# EAGLE design Prop_Fan (EAGLE 6.6.0)
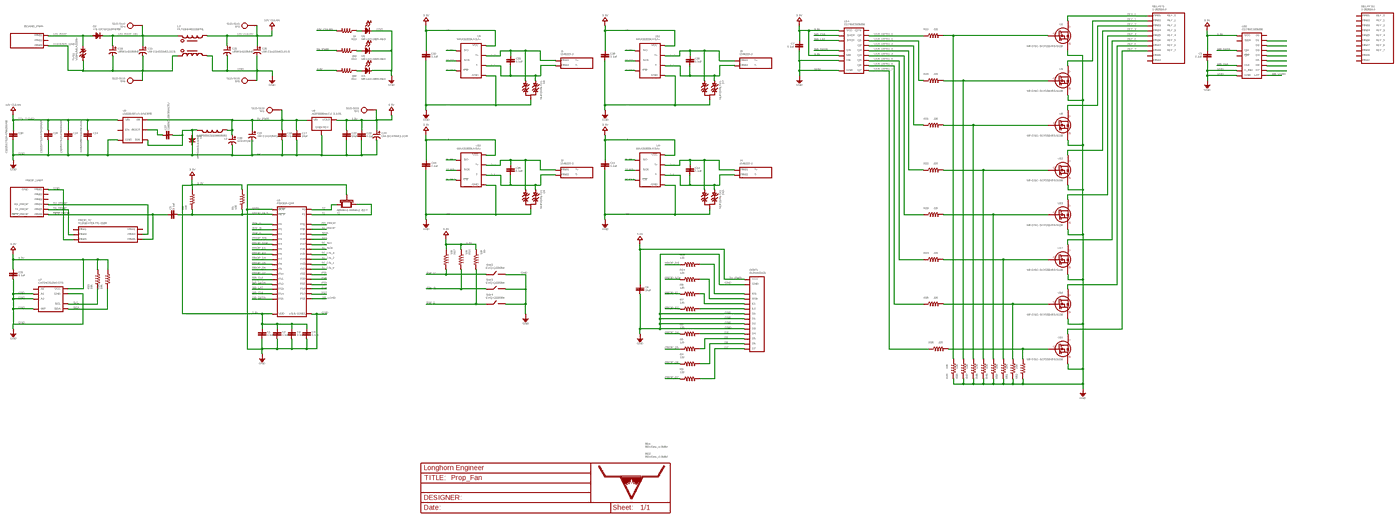
[diagram p0: schematic, sheet 1, overview]
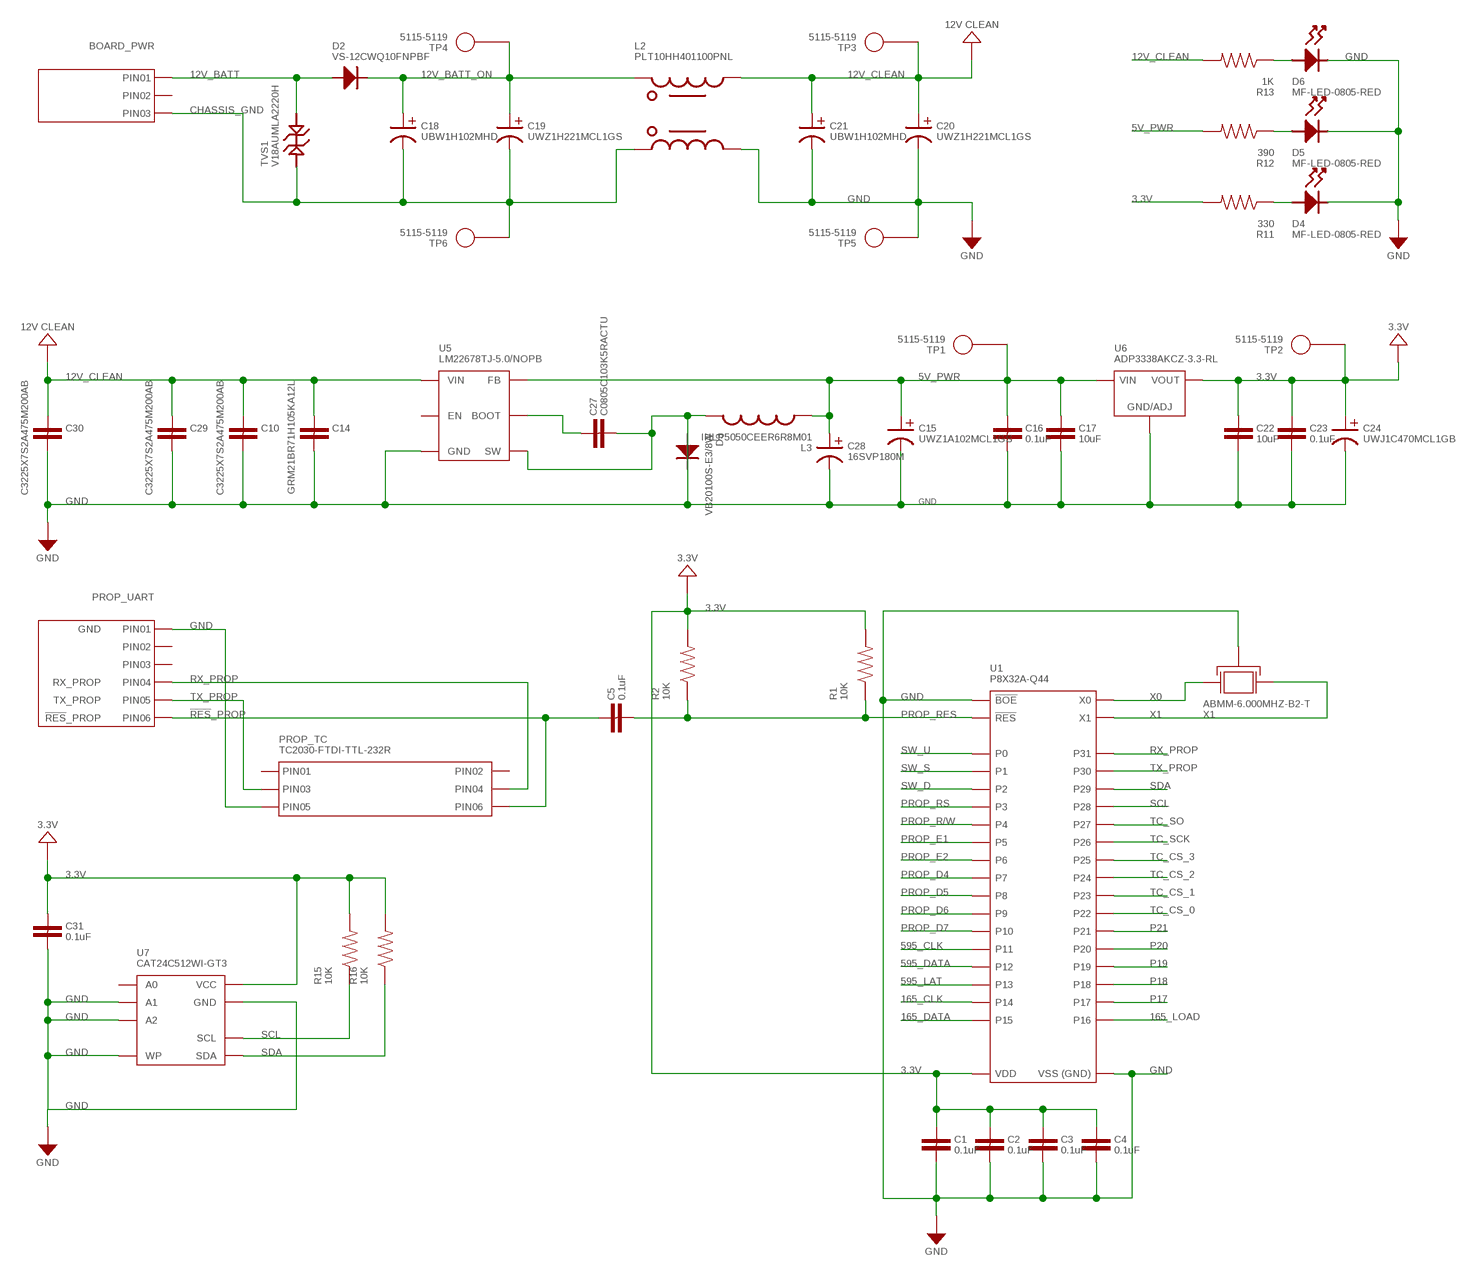
[diagram p1: schematic, sheet 1, part 1 of 4]
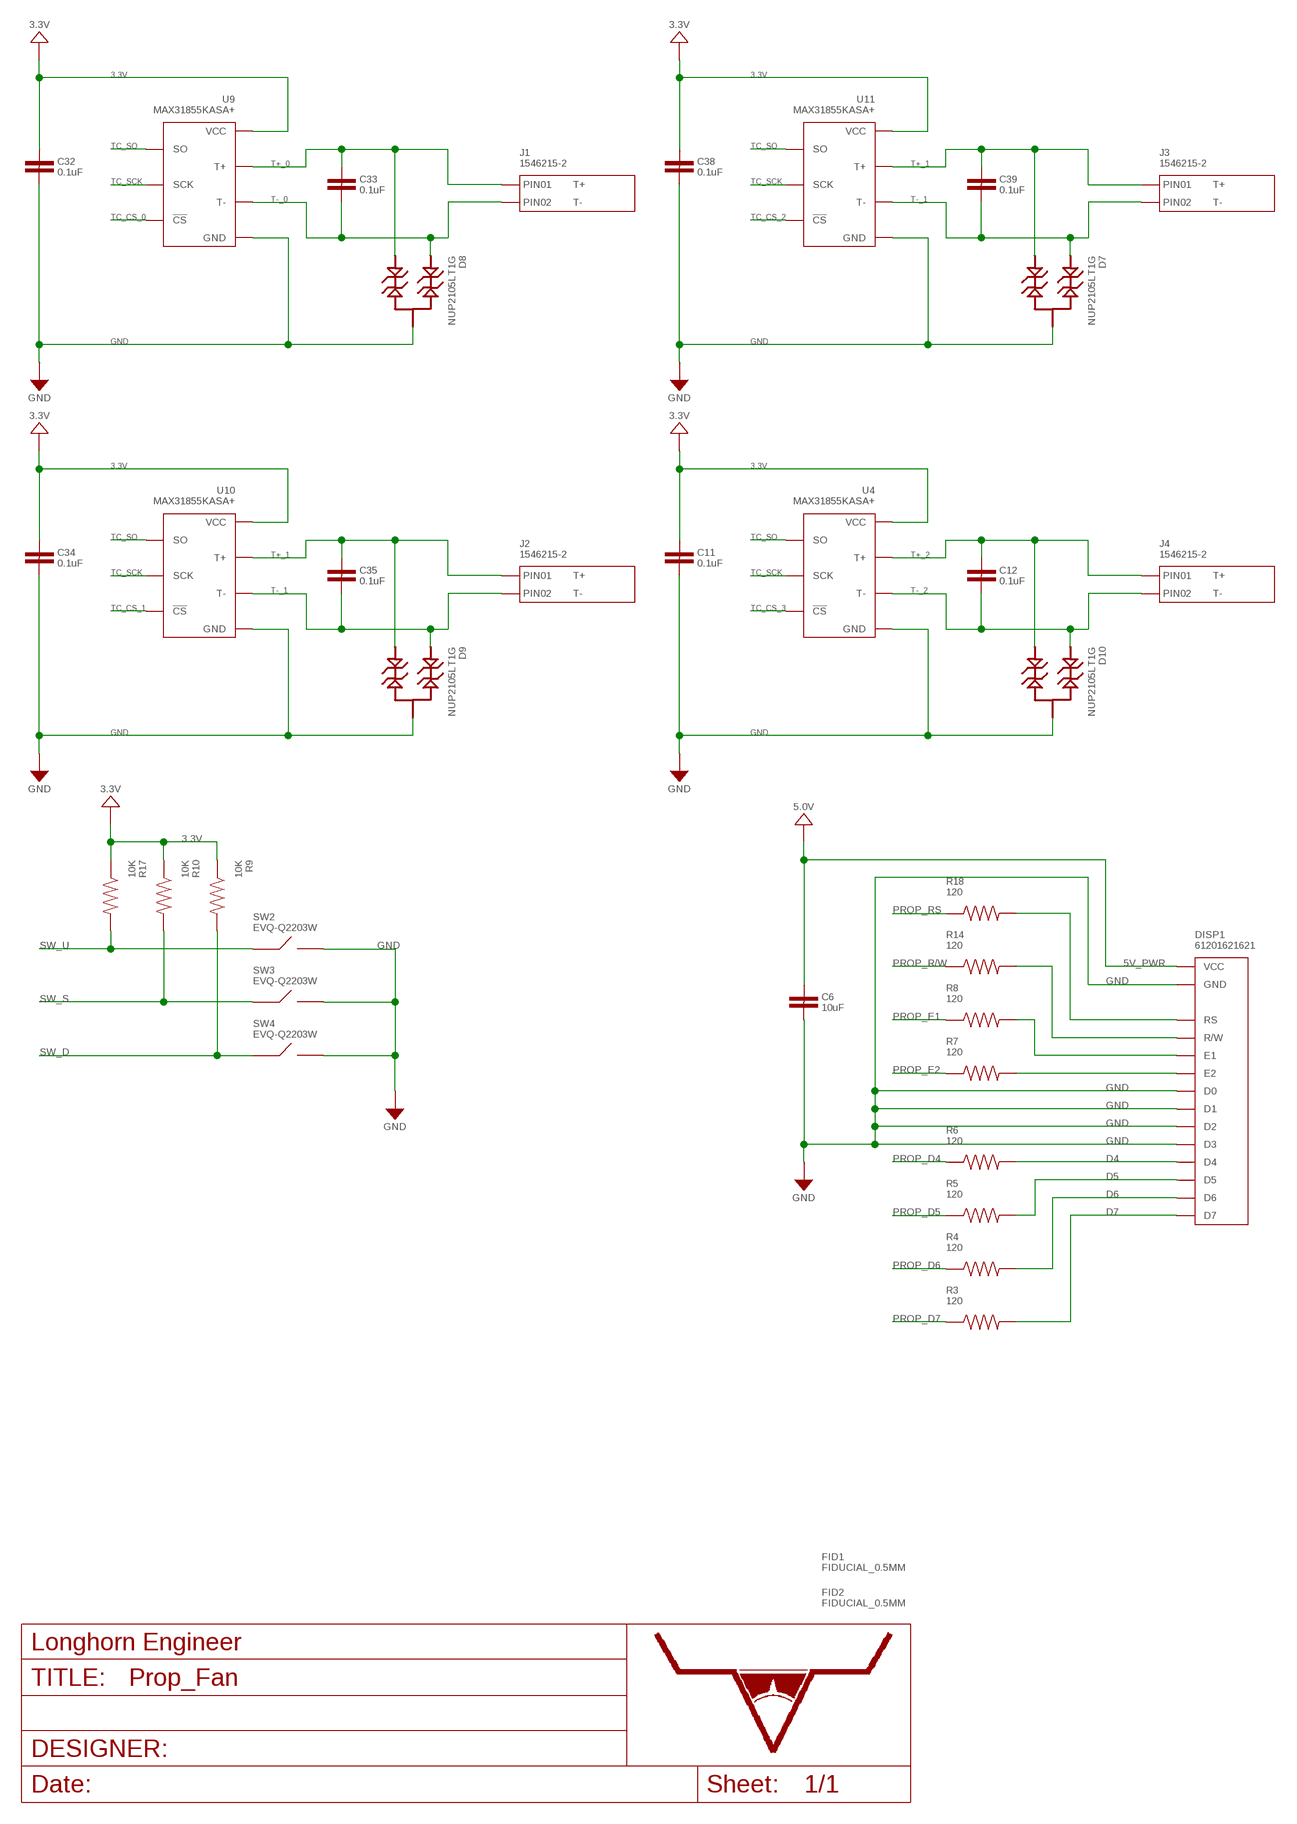
[diagram p2: schematic, sheet 1, part 2 of 4]
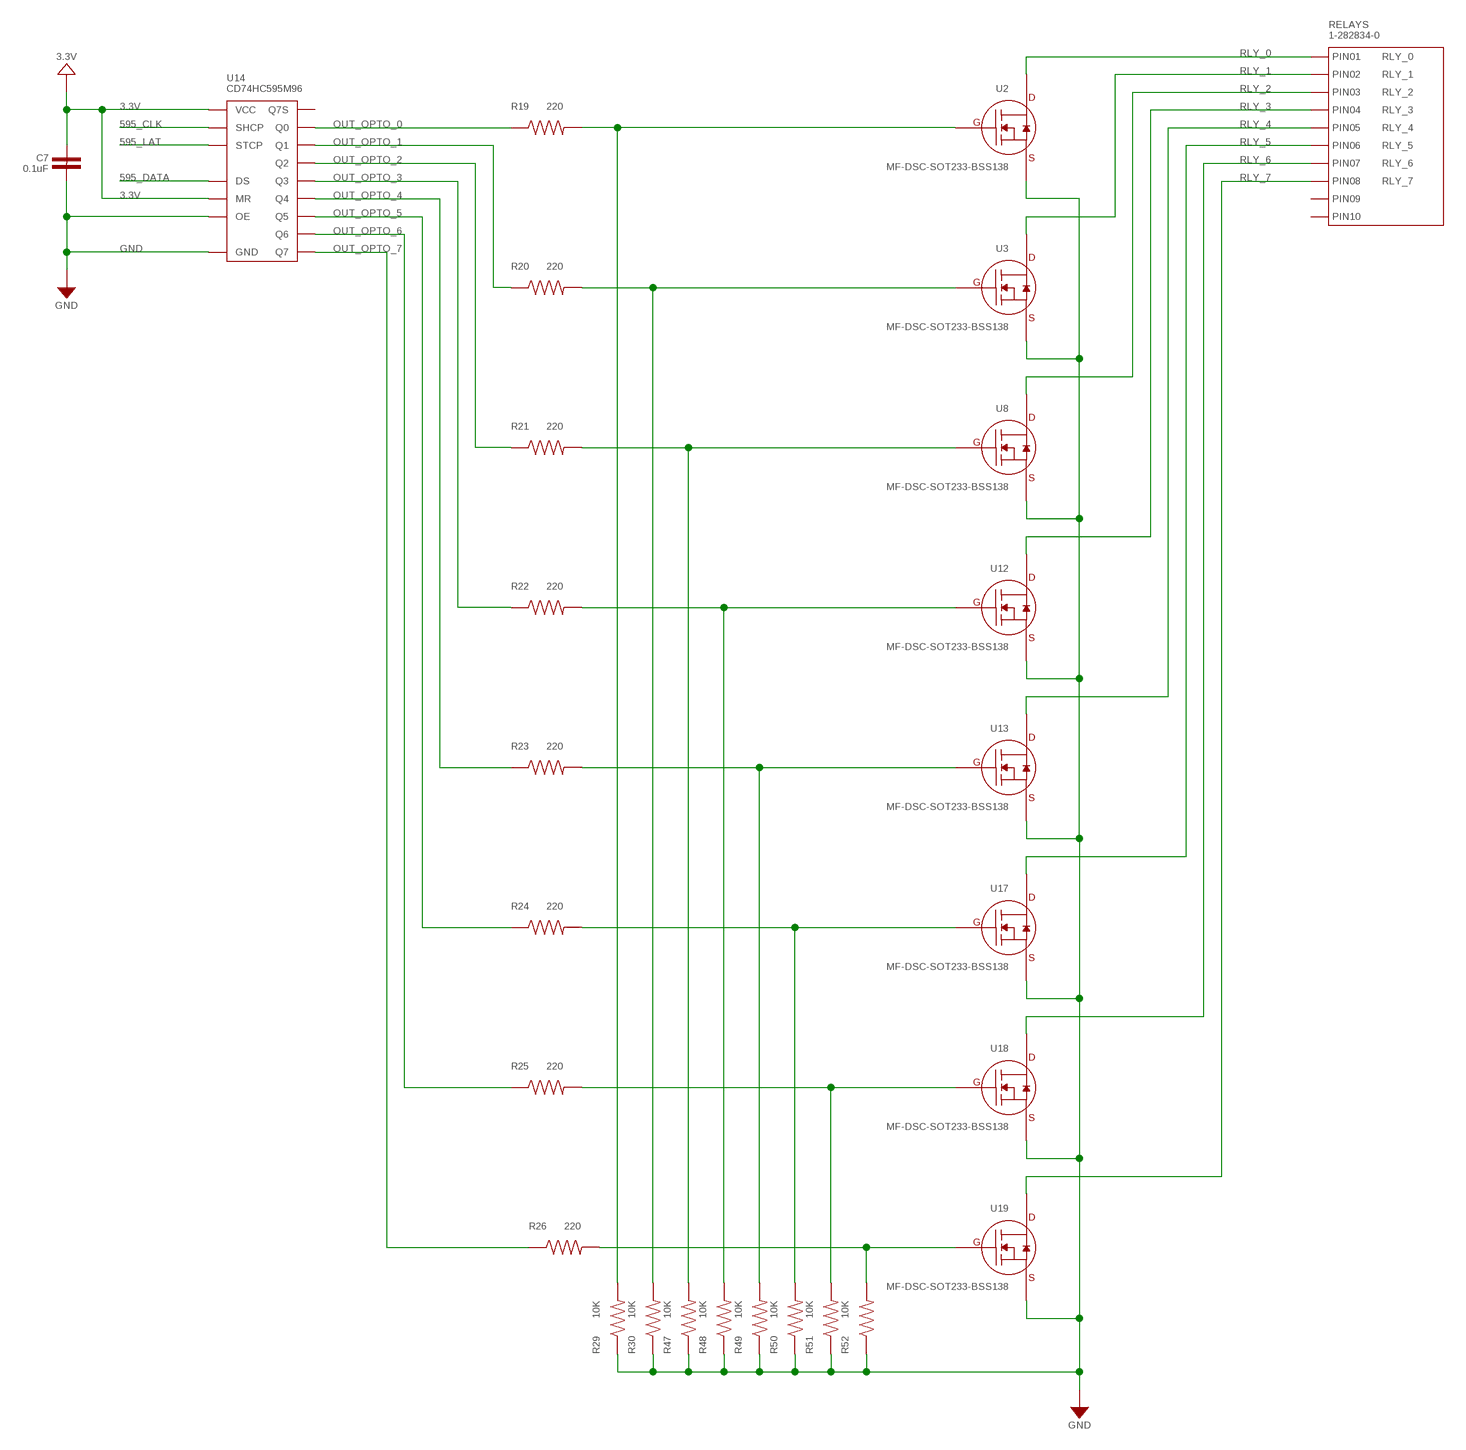
[diagram p3: schematic, sheet 1, part 3 of 4]
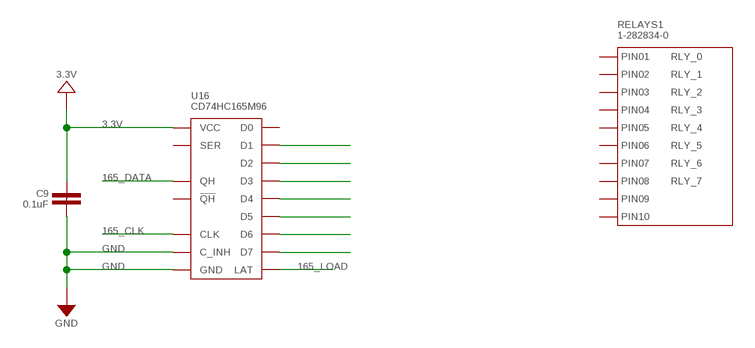
[diagram p4: schematic, sheet 1, part 4 of 4]

## Parts
BOARD_PWR  CON_01X03_640454-3  [640454-3]
C1  0.1uF  CAPACITOR_NON_POLAR_0805  [0805]
C2  0.1uF  CAPACITOR_NON_POLAR_0805  [0805]
C3  0.1uF  CAPACITOR_NON_POLAR_0805  [0805]
C4  0.1uF  CAPACITOR_NON_POLAR_0805  [0805]
C5  0.1uF  CAPACITOR_NON_POLAR_0805  [0805]
C6  10uF  CAPACITOR_NON_POLAR_0805  [0805]
C7  0.1uF  CAPACITOR_NON_POLAR_0805  [0805]
C9  0.1uF  CAPACITOR_NON_POLAR_0805  [0805]
C10  C3225X7S2A475M200AB  CAPACITOR_NON_POLAR_1210  [1210]
C11  0.1uF  CAPACITOR_NON_POLAR_0805  [0805]
C12  0.1uF  CAPACITOR_NON_POLAR_0805  [0805]
C14  GRM21BR71H105KA12L  CAPACITOR_NON_POLAR_0805  [0805]
C15  UWZ1A102MCL1GS  CAPACITOR_POLARIZED_10MM_SMD  [10MM_CAP_SMD]
C16  0.1uF  CAPACITOR_NON_POLAR_0805  [0805]
C17  10uF  CAPACITOR_NON_POLAR_0805  [0805]
C18  UBW1H102MHD  CAPACITOR_POLARIZED_12.5MM_PTH  [12.5MM_CAP_PTH]
C19  UWZ1H221MCL1GS  CAPACITOR_POLARIZED_10MM_SMD  [10MM_CAP_SMD]
C20  UWZ1H221MCL1GS  CAPACITOR_POLARIZED_10MM_SMD  [10MM_CAP_SMD]
C21  UBW1H102MHD  CAPACITOR_POLARIZED_12.5MM_PTH  [12.5MM_CAP_PTH]
C22  10uF  CAPACITOR_NON_POLAR_0805  [0805]
C23  0.1uF  CAPACITOR_NON_POLAR_0805  [0805]
C24  UWJ1C470MCL1GB  CAPACITOR_POLARIZED_6.3MM_SMD  [6.3MM_CAP_SMD]
C27  C0805C103K5RACTU  CAPACITOR_NON_POLAR_0805  [0805]
C28  16SVP180M  CAPACITOR_POLARIZED_8MM_SMD  [8MM_CAP_SMD]
C29  C3225X7S2A475M200AB  CAPACITOR_NON_POLAR_1210  [1210]
C30  C3225X7S2A475M200AB  CAPACITOR_NON_POLAR_1210  [1210]
C31  0.1uF  CAPACITOR_NON_POLAR_0805  [0805]
C32  0.1uF  CAPACITOR_NON_POLAR_0805  [0805]
C33  0.1uF  CAPACITOR_NON_POLAR_0805  [0805]
C34  0.1uF  CAPACITOR_NON_POLAR_0805  [0805]
C35  0.1uF  CAPACITOR_NON_POLAR_0805  [0805]
C38  0.1uF  CAPACITOR_NON_POLAR_0805  [0805]
C39  0.1uF  CAPACITOR_NON_POLAR_0805  [0805]
D2  VS-12CWQ10FNPBF  DIODE_D-PAK(TO-252AA)  [D-PAK(TO-252AA)]
D3  VB20100S-E3/8W  DIODE_D2PAK(TO-263AB)  [D2PAK(TO-263AB)]
D4  MF-LED-0805-RED  LED_SINGLE_0805  [LED_0805]
D5  MF-LED-0805-RED  LED_SINGLE_0805  [LED_0805]
D6  MF-LED-0805-RED  LED_SINGLE_0805  [LED_0805]
D7  NUP2105LT1G  TVS_DIODE_DUALSOT-23  [SOT-23]
D8  NUP2105LT1G  TVS_DIODE_DUALSOT-23  [SOT-23]
D9  NUP2105LT1G  TVS_DIODE_DUALSOT-23  [SOT-23]
D10  NUP2105LT1G  TVS_DIODE_DUALSOT-23  [SOT-23]
DISP1  61201621621  CU40056-UW1J  [CU40045-UW1J]
FID1  FIDUCIAL_0.5MM  [FIDUCIAL_0.5MM]
FID2  FIDUCIAL_0.5MM  [FIDUCIAL_0.5MM]
J1  1546215-2  CON_01X02_1546215-2  [1546215-2]
J2  1546215-2  CON_01X02_1546215-2  [1546215-2]
J3  1546215-2  CON_01X02_1546215-2  [1546215-2]
J4  1546215-2  CON_01X02_1546215-2  [1546215-2]
L2  PLT10HH401100PNL  COMMON_MODE_INDUCTOR_PLT10H  [PLT10H]
L3  IHLP5050CEER6R8M01  INDUCTOR_IHLP-5050  [IHLP-5050]
PROP_TC  TC2030-FTDI-TTL-232R  CON_02X03_TC2030  [TC2030]
PROP_UART  CON_01X06_2.54MM_PIN_HEADER  [2.54MM_01X06_PIN_HEADER]
R1  10K  RESISTOR_0805  [0805]
R2  10K  RESISTOR_0805  [0805]
R3  120  RESISTOR_0805  [0805]
R4  120  RESISTOR_0805  [0805]
R5  120  RESISTOR_0805  [0805]
R6  120  RESISTOR_0805  [0805]
R7  120  RESISTOR_0805  [0805]
R8  120  RESISTOR_0805  [0805]
R9  10K  RESISTOR_0805  [0805]
R10  10K  RESISTOR_0805  [0805]
R11  330  RESISTOR_0805  [0805]
R12  390  RESISTOR_0805  [0805]
R13  1K  RESISTOR_0805  [0805]
R14  120  RESISTOR_0805  [0805]
R15  10K  RESISTOR_0805  [0805]
R16  10K  RESISTOR_0805  [0805]
R17  10K  RESISTOR_0805  [0805]
R18  120  RESISTOR_0805  [0805]
R19  220  RESISTOR_0603  [R0603]
R20  220  RESISTOR_0603  [R0603]
R21  220  RESISTOR_0603  [R0603]
R22  220  RESISTOR_0603  [R0603]
R23  220  RESISTOR_0603  [R0603]
R24  220  RESISTOR_0603  [R0603]
R25  220  RESISTOR_0603  [R0603]
R26  220  RESISTOR_0603  [R0603]
R29  10K  RESISTOR_0603  [R0603]
R30  10K  RESISTOR_0603  [R0603]
R47  10K  RESISTOR_0603  [R0603]
R48  10K  RESISTOR_0603  [R0603]
R49  10K  RESISTOR_0603  [R0603]
R50  10K  RESISTOR_0603  [R0603]
R51  10K  RESISTOR_0603  [R0603]
R52  10K  RESISTOR_0603  [R0603]
RELAYS  1-282834-0  CON_01X10_1-282834-0  [1-282834-0]
RELAYS1  1-282834-0  CON_01X10_1-282834-0  [1-282834-0]
SW2  EVQ-Q2203W  SPST_EVQ-Q2203W  [EVQ-Q2203W]
SW3  EVQ-Q2203W  SPST_EVQ-Q2203W  [EVQ-Q2203W]
SW4  EVQ-Q2203W  SPST_EVQ-Q2203W  [EVQ-Q2203W]
TP1  5115-5119  TEST_POINT_SINGLE_KEYSTONE_5115-5119  [KEYSTONE_5115-5119]
TP2  5115-5119  TEST_POINT_SINGLE_KEYSTONE_5115-5119  [KEYSTONE_5115-5119]
TP3  5115-5119  TEST_POINT_SINGLE_KEYSTONE_5115-5119  [KEYSTONE_5115-5119]
TP4  5115-5119  TEST_POINT_SINGLE_KEYSTONE_5115-5119  [KEYSTONE_5115-5119]
TP5  5115-5119  TEST_POINT_SINGLE_KEYSTONE_5115-5119  [KEYSTONE_5115-5119]
TP6  5115-5119  TEST_POINT_SINGLE_KEYSTONE_5115-5119  [KEYSTONE_5115-5119]
TVS1  V18AUMLA2220H  TVS_DIODE_2220  [2220]
U1  P8X32A-Q44  [LQFP44]
U2  MF-DSC-SOT233-BSS138  N-CHANNEL_FET_SOT-23-3  [SOT-23-3]
U3  MF-DSC-SOT233-BSS138  N-CHANNEL_FET_SOT-23-3  [SOT-23-3]
U4  MAX31855KASA+  MAX31855  [MAX31855_SO-8]
U5  LM22678TJ-5.0/NOPB  LM22678  [LM22678_TO-263-EP-7]
U6  ADP3338AKCZ-3.3-RL  LINEAR_VOTLAGE_REGULATORS_ADP3338  [ADP3338_SOT-223-3]
U7  CAT24C512WI-GT3  EEPROM_I2CSOIC-8_W  [SOIC-8_W]
U8  MF-DSC-SOT233-BSS138  N-CHANNEL_FET_SOT-23-3  [SOT-23-3]
U9  MAX31855KASA+  MAX31855  [MAX31855_SO-8]
U10  MAX31855KASA+  MAX31855  [MAX31855_SO-8]
U11  MAX31855KASA+  MAX31855  [MAX31855_SO-8]
U12  MF-DSC-SOT233-BSS138  N-CHANNEL_FET_SOT-23-3  [SOT-23-3]
U13  MF-DSC-SOT233-BSS138  N-CHANNEL_FET_SOT-23-3  [SOT-23-3]
U14  CD74HC595M96  [CD74HC595_SOIC-16]
U16  CD74HC165M96  [CD74HC165_SOIC-16]
U17  MF-DSC-SOT233-BSS138  N-CHANNEL_FET_SOT-23-3  [SOT-23-3]
U18  MF-DSC-SOT233-BSS138  N-CHANNEL_FET_SOT-23-3  [SOT-23-3]
U19  MF-DSC-SOT233-BSS138  N-CHANNEL_FET_SOT-23-3  [SOT-23-3]
U$1  LHE_FRAME  [LHE_FRAME]
X1  ABMM-6.000MHZ-B2-T  XTL_7MMX5MM  [7MMX5MM]

## Nets
3.3V: C1.1 C2.1 C3.1 C4.1 C7.1 C9.1 C11.1 C22.1 C23.1 C24.POS C31.1 C32.1 C34.1 C38.1 R1.2 R2.2 R9.1 R10.1 R11.2 R15.2 R16.2 R17.1 TP2.P$1 U1.8(VDD) U1.18(VDD) U1.30(VDD) U1.40(VDD) U4.4(VCC) U6.2(OUT) U6.PAD(OUT) U7.8(VCC) U9.4(VCC) U10.4(VCC) U11.4(VCC) U14.10(MR) U14.16(VCC) U16.16(VCC)
5V_PWR: C6.1 C15.POS C16.1 C17.1 C28.POS DISP1.P$14(VCC) L3.1 R12.2 TP1.P$1 U5.P$6(FB) U6.3(IN) ; supply symbol labelled 5.0V
12V_BATT: BOARD_PWR.P$1(PIN1) D2.1(ANODE) D2.3(ANODE) TVS1.P$2
12V_BATT_ON: C18.POS C19.POS D2.PAD-4(CATHODE) L2.1 TP4.P$1
12V_CLEAN: C10.1 C14.1 C20.POS C21.POS C29.1 C30.1 L2.2 R13.2 TP3.P$1 U5.P$2(VIN) ; supply symbol labelled 12V CLEAN
165_CLK: U1.15(P14) U16.2(CLK)
165_DATA: U1.16(P15) U16.9(QH)
165_LOAD: U1.19(P16) U16.1(LAT)
595_CLK: U1.12(P11) U14.11(SHCP)
595_DATA: U1.13(P12) U14.14(DS)
595_LAT: U1.14(P13) U14.12(STCP)
!RES!_PROP: C5.1 PROP_TC.P$6(PIN6) PROP_UART.6
CHASSIS_GND: BOARD_PWR.P$3(PIN3) C18.NEG C19.NEG L2.4 TP6.P$1 TVS1.P$1
D4: DISP1.P$4(D4) R6.2
D5: DISP1.P$3(D5) R5.2
D6: DISP1.P$2(D6) R4.2
D7: DISP1.P$1(D7) R3.2
E1: DISP1.P$9(E1) R8.2
E2: DISP1.P$15(E2) R7.2
GND: C1.2 C2.2 C3.2 C4.2 C6.2 C7.2 C9.2 C10.2 C11.2 C14.2 C15.NEG C16.2 C17.2 C20.NEG C21.NEG C22.2 C23.2 C24.NEG C28.NEG C29.2 C30.2 C31.2 C32.2 C34.2 C38.2 D3.A(ANODE) D4.CATHODE D5.CATHODE D6.CATHODE D7.3 D8.3 D9.3 D10.3 DISP1.P$5(D3) DISP1.P$6(D2) DISP1.P$7(D1) DISP1.P$8(D0) DISP1.P$13(GND) L2.3 PROP_TC.P$5(PIN5) PROP_UART.1 SW2.3(B) SW2.4(B) SW3.3(B) SW3.4(B) SW4.3(B) SW4.4(B) TP5.P$1 U1.5(VSS) U1.6(BOE') U1.17(VSS) U1.27(VSS) U1.39(VSS) U4.1(GND) U5.P$4(GND) U5.PAD(GND) U6.1(GND) U7.2(A1) U7.3(A2) U7.4(GND) U7.7(WP) U9.1(GND) U10.1(GND) U11.1(GND) U14.8(GND) U14.13(OE) U16.8(GND) U16.15(C_INH) X1.P$2(GND) X1.P$4(GND)
IN_OPTO_1: U16.12(D1)
IN_OPTO_2: U16.13(D2)
IN_OPTO_3: U16.14(D3)
IN_OPTO_4: U16.3(D4)
IN_OPTO_5: U16.4(D5)
IN_OPTO_6: U16.5(D6)
IN_OPTO_7: U16.6(D7)
N$2: C27.1 U5.P$3(BOOT)
N$5: C27.2 D3.C(CATHODE) L3.2 U5.P$1(SW)
N$7: D6.ANODE R13.1
N$8: D5.ANODE R12.1
N$9: D4.ANODE R11.1
N$11: R19.P$2 R29.P$2 U2.P$1(GATE)
N$12: R20.P$2 R30.P$2 U3.P$1(GATE)
N$13: R21.P$2 R47.P$2 U8.P$1(GATE)
N$14: R22.P$2 R48.P$2 U12.P$1(GATE)
N$15: R23.P$2 R49.P$2 U13.P$1(GATE)
N$16: R24.P$2 R50.P$2 U17.P$1(GATE)
N$17: R25.P$2 R51.P$2 U18.P$1(GATE)
N$18: R26.P$2 R52.P$2 U19.P$1(GATE)
OUT_OPTO_0: R19.P$1 U14.15(Q0)
OUT_OPTO_1: R20.P$1 U14.1(Q1)
OUT_OPTO_2: R21.P$1 U14.2(Q2)
OUT_OPTO_3: R22.P$1 U14.3(Q3)
OUT_OPTO_4: R23.P$1 U14.4(Q4)
OUT_OPTO_5: R24.P$1 U14.5(Q5)
OUT_OPTO_6: R25.P$1 U14.6(Q6)
OUT_OPTO_7: R26.P$1 U14.7(Q7)
P17: U1.20(P17)
P18: U1.21(P18)
P19: U1.22(P19)
P20: U1.23(P20)
P21: U1.24(P21)
P$1: R29.P$1 R30.P$1 R47.P$1 R48.P$1 R49.P$1 R50.P$1 R51.P$1 R52.P$1 U2.P$2(SOURCE) U3.P$2(SOURCE) U8.P$2(SOURCE) U12.P$2(SOURCE) U13.P$2(SOURCE) U17.P$2(SOURCE) U18.P$2(SOURCE) U19.P$2(SOURCE) ; supply symbol labelled GND
PROP_D4: R6.1 U1.4(P7)
PROP_D5: R5.1 U1.9(P8)
PROP_D6: R4.1 U1.10(P9)
PROP_D7: R3.1 U1.11(P10)
PROP_E1: R8.1 U1.2(P5)
PROP_E2: R7.1 U1.3(P6)
PROP_R/W: R14.1 U1.1(P4)
PROP_RES: C5.2 R1.1 R2.1 U1.7(RES')
PROP_RS: R18.1 U1.44(P3)
R/W: DISP1.P$10(R/W) R14.2
RLY_0: RELAYS.P$1 U2.P$3(DRAIN)
RLY_1: RELAYS.P$2 U3.P$3(DRAIN)
RLY_2: RELAYS.P$3 U8.P$3(DRAIN)
RLY_3: RELAYS.P$4 U12.P$3(DRAIN)
RLY_4: RELAYS.P$5 U13.P$3(DRAIN)
RLY_5: RELAYS.P$6 U17.P$3(DRAIN)
RLY_6: RELAYS.P$7 U18.P$3(DRAIN)
RLY_7: RELAYS.P$8 U19.P$3(DRAIN)
RS: DISP1.P$11(RS) R18.2
RX_PROP: PROP_TC.P$4(PIN4) PROP_UART.4 U1.38(P31)
SCL: R15.1 U1.35(P28) U7.6(SCL)
SDA: R16.1 U1.36(P29) U7.5(SDA)
SW_D: R9.2 SW4.1(A) SW4.2(A) U1.43(P2)
SW_S: R10.2 SW3.1(A) SW3.2(A) U1.42(P1)
SW_U: R17.2 SW2.1(A) SW2.2(A) U1.41(P0)
T+_0: C33.1 D8.2 J1.P$1(PIN1) U9.3(T+)
T+_1: C35.1 C39.1 D7.2 D9.2 J2.P$1(PIN1) J3.P$1(PIN1) U10.3(T+) U11.3(T+)
T+_2: C12.1 D10.2 J4.P$1(PIN1) U4.3(T+)
T-_0: C33.2 D8.1 J1.P$2(PIN2) U9.2(T-)
T-_1: C35.2 C39.2 D7.1 D9.1 J2.P$2(PIN2) J3.P$2(PIN2) U10.2(T-) U11.2(T-)
T-_2: C12.2 D10.1 J4.P$2(PIN2) U4.2(T-)
TC_CS_0: U1.25(P22) U9.6(!CS)
TC_CS_1: U1.26(P23) U10.6(!CS)
TC_CS_2: U1.31(P24) U11.6(!CS)
TC_CS_3: U1.32(P25) U4.6(!CS)
TC_SCK: U1.33(P26) U4.5(SCK) U9.5(SCK) U10.5(SCK) U11.5(SCK)
TC_SO: U1.34(P27) U4.7(SO) U9.7(SO) U10.7(SO) U11.7(SO)
TX_PROP: PROP_TC.P$3(PIN3) PROP_UART.5 U1.37(P30)
X0: U1.29(X0) X1.P$1(X0)
X1: U1.28(X1) X1.P$3(X1)
Unconnected: BOARD_PWR.P$2(PIN2) PROP_TC.P$1(PIN1) PROP_TC.P$2(PIN2) PROP_UART.2 PROP_UART.3 RELAYS1.P$1 RELAYS1.P$2 RELAYS1.P$3 RELAYS1.P$4 RELAYS1.P$5 RELAYS1.P$6 RELAYS1.P$7 RELAYS1.P$8 RELAYS1.P$9 RELAYS1.P$10 RELAYS.P$9 RELAYS.P$10 U5.P$7(EN) U7.1(A0) U14.9(Q7S) U16.7(QH') U16.10(SER) U16.11(D0)

## Library data of the parts
BOARD_PWR = PP_Connectors:CON_01X03: 3 pin connectors
C1-C7 C9-C12 C14 C16 C17 C22 C23 C27 C29-C35 C38 C39 = PP_Passives:CAPACITOR_NON_POLAR: Capacitor Non Polarized
C15 C18-C21 C24 C28 = PP_Passives:CAPACITOR_POLARIZED: Polarized capacitors
D2 D3 = PP_Passives:DIODE: Diode - Single
D4-D6 = PP_LED:LED_SINGLE
D7-D10 = PP_Passives:TVS_DIODE_DUAL
DISP1 = PP_Displays:CU40056-UW1J
FID1 FID2 = MF_Aesthetics:FIDUCIAL: Library: MF_Aesthetics Description: Fiducial marking for PCB alignment inside PNP and other machines.
J1-J4 = PP_Connectors:CON_01X02; LABEL01: T+; LABEL02: T-
L2 = PP_Passives:COMMON_MODE_INDUCTOR
L3 = PP_Passives:INDUCTOR: Inductors
PROP_TC = PP_Connectors:CON_02X03
PROP_UART = PP_Connectors:CON_01X06: 6 pin connectors; LABEL01: GND; LABEL04: RX_PROP; LABEL05: TX_PROP; LABEL06: !RES!_PROP
R1-R18 = PP_Passives:RESISTOR: Resistors
R19-R26 R29 R30 R47-R52 = MF_Passives:RESISTOR: Library: MF_Passives Description: Device for Resistors. Manufacture part number (MFG#), Voltage, Tolerance, and Wattage Rating can be added via Attributes.; MFG#: N/A; TOLERANCE: N/A; VOLTAGE: N/A; WATTAGE: N/A
RELAYS RELAYS1 = PP_Connectors:CON_01X10; LABEL01: RLY_0; LABEL02: RLY_1; LABEL03: RLY_2; LABEL04: RLY_3; LABEL05: RLY_4; LABEL06: RLY_5; LABEL07: RLY_6; LABEL08: RLY_7
SW2-SW4 = PP_Electromechanical:SPST: SPST Switches
TP1-TP6 = PP_Connectors:TEST_POINT_SINGLE
TVS1 = PP_Passives:TVS_DIODE
U1 = MF_IC_Digital:P8X32A: Manufacturer Part #: P8X32A Manufacturer: Parallax Description: 32-bit Microcontrollers - MCU LQFP pkg Propeller Chip
U2 U3 U8 U12 U13 U17-U19 = MF_Discrete_Semiconductor:N-CHANNEL_FET: Library: MF_Discrete_Semiconductor Description: Device for Single N-Channel Mosfet. Manufacture part number (MFG#) can be added via Attributes.
U4 U9-U11 = PP_Sensors:MAX31855: Manufacturer Part #: MAX31855 Manufacturer: Maxim Integrated Description: Sensor Interface Thermocouple To Digital Converter
U5 = PP_PowerIC:LM22678: Manufacturer Part #: LM22678 Manufacturer: Texas Instruments Description: Voltage Regulators - Switching Regulators 5A STEP-DOWN VLTG REG
U6 = PP_PowerIC:LINEAR_VOTLAGE_REGULATORS
U7 = PP_DigitalIC:EEPROM_I2C
U14 = PP_DigitalIC:CD74HC595: Manufacturer Part #: CD74HC595 Manufacturer: Texas Instruments Description: Counter Shift Registers 8-Bit Shift Register
U16 = PP_DigitalIC:CD74HC165: Manufacturer Part #: CD74HC165 Manufacturer: Texas Instruments Description: Counter Shift Registers High Speed CMOS 8-Bit Shift Register
U$1 = PP_Aesthetics:LHE_FRAME; DNAME: Parker Dillmann; REVNUM: REV: 1
X1 = MF_Frequency_Control:XTL: Library: MF_Frequency_Control Description: Device for Cyrstal Oscillators. Manufacture part number (MFG#) can be added via Attributes.

## Net classes
0 default: width 0.254 mm, drill 0.5 mm, clearance 0.152 mm

## Board
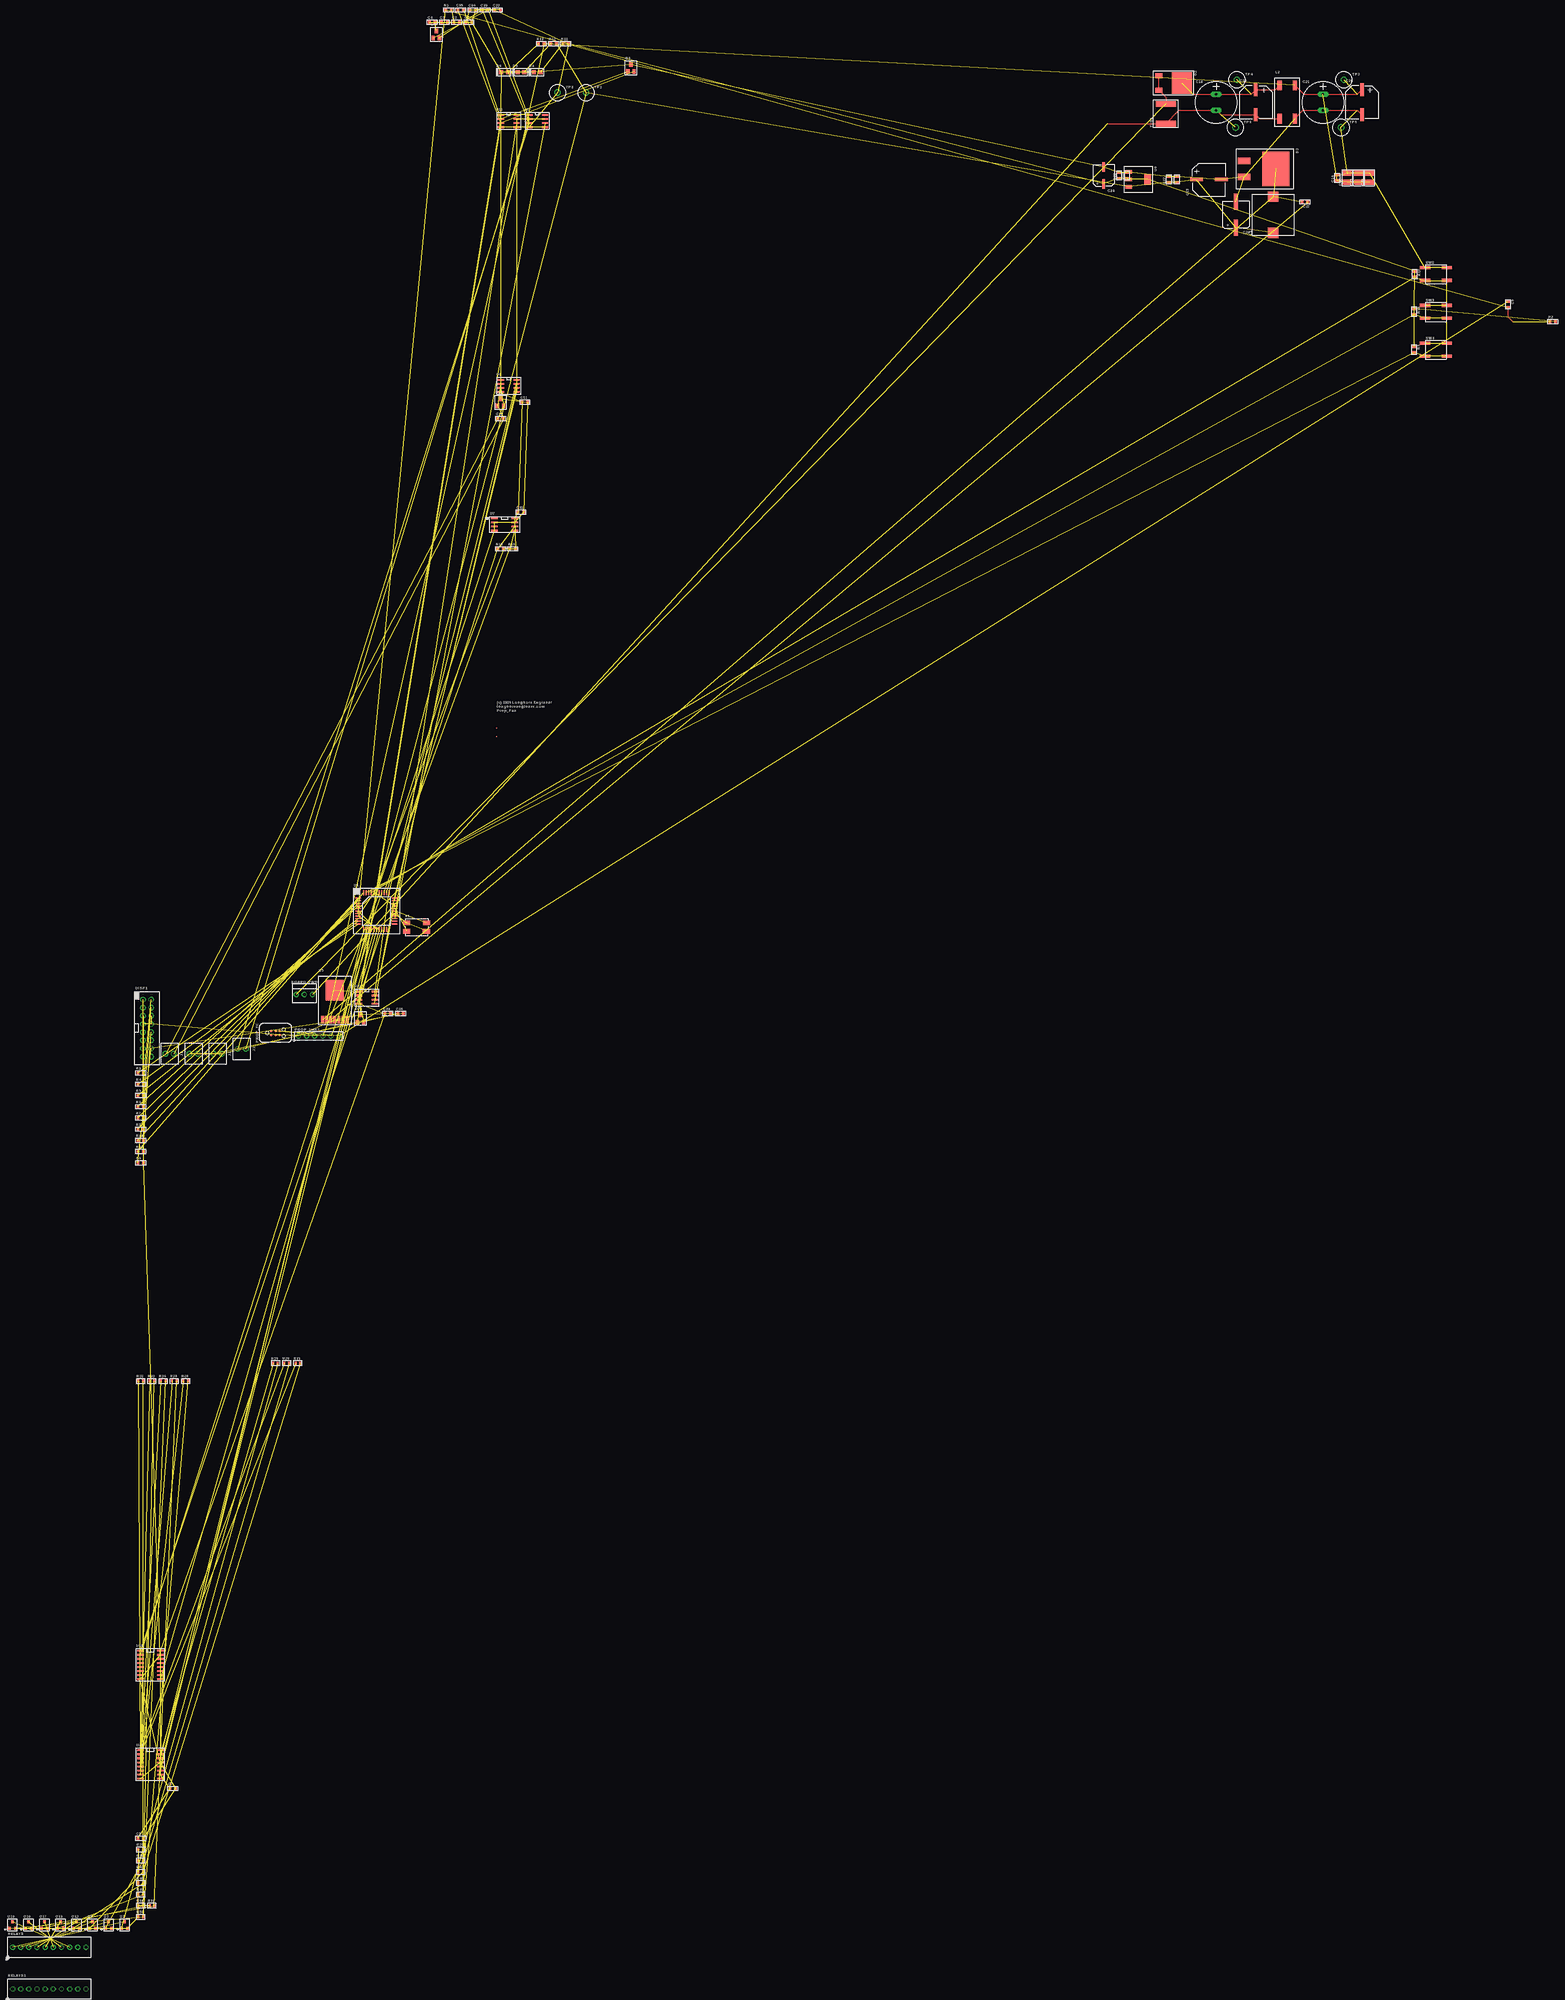
[diagram p5: board, top side]

No outline drawn. Coordinates in mm, seen from the top.
Copper layers (1*16): Top 0.035mm / dielectric 1.5mm / Bottom 0.035mm
Design rules "default": minimum track width 10mil, minimum drill 24mil, track to track 8mil, track to pad 8mil, pad to pad 8mil, via to via 8mil, smd to smd 8mil, copper to edge 40mil, drill to drill 8mil, minimum pad ring 10mil, minimum via ring 8mil, stop-mask expansion 4mil, vias tented up to drill 0mil, thermal gap 10mil

### Footprints (pad centres in the part's own frame; a part is rotated, then mirrored left to right if it is on the bottom)
640454-3 = drill 1: P$1 -2.54,0; P$2 0,0; P$3 2.54,0
0805 = smd 0.8 x 1.2: 1 -0.9,0; 2 0.9,0
1210 = smd 1.6 x 2.6: 1 -1.4,0; 2 1.4,0
10MM_CAP_SMD = smd 1.1 x 4: NEG 0,-3.88; POS 0,3.88
12.5MM_CAP_PTH = drill 0.7 pad 1.676 long: NEG 0,-2.5; POS 0,2.5
6.3MM_CAP_SMD = smd 0.8 x 3: NEG 0,-2.6; POS 0,2.6
8MM_CAP_SMD = smd 1.1 x 5: NEG 0,-4.05; POS 0,4.05
D-PAK(TO-252AA) = smd 1.524 x 2.286: 1 -2.261,-10.249; 3 2.261,-10.249 | smd 6.731 x 6.223: PAD-4 0,-3.111
D2PAK(TO-263AB) = smd 2.032 x 3.81: A 2.5,-5.169; NOP -2.5,-5.205 | smd 10.66 x 8.38: C 0,4.7
LED_0805 = smd 1.2 x 1.2: ANODE 1.05,0; CATHODE -1.05,0
SOT-23 = smd 1 x 1.4: 1 -0.95,-1.1; 2 0.95,-1.1; 3 0,1.1
CU40045-UW1J = drill 1.1: P$1 -1.27,8.89; P$2 1.27,8.89; P$3 -1.27,6.35; P$4 1.27,6.35; P$5 -1.27,3.81; P$6 1.27,3.81; P$7 -1.27,1.27; P$8 1.27,1.27; P$9 -1.27,-1.27; P$10 1.27,-1.27; P$11 -1.27,-3.81; P$12 1.27,-3.81; P$13 -1.27,-6.35; P$14 1.27,-6.35; P$15 -1.27,-8.89; P$16 1.27,-8.89
FIDUCIAL_0.5MM = smd 0.5 x 0.5: FID 0,0
1546215-2 = drill 1.1 octagon: P$1 -1.27,0; P$2 1.27,0
PLT10H = smd 1.3 x 3: 1 -2.35,5.2; 2 2.35,5.2; 3 2.35,-5.2; 4 -2.35,-5.2
IHLP-5050 = smd 3.175 x 3.251: 1 -5.664,0; 2 5.664,0
TC2030 = smd 0.787 x 0.787: P$1 -1.27,-0.635; P$2 -1.27,0.635; P$3 0,-0.635; P$4 0,0.635; P$5 1.27,-0.635; P$6 1.27,0.635 | hole 0.991: 2.54,1.016; 2.54,-1.016; -2.54,0
2.54MM_01X06_PIN_HEADER = drill 1: 1 -6.35,0; 2 -3.81,0; 3 -1.27,0; 4 1.27,0; 5 3.81,0; 6 6.35,0
R0603 = smd 0.6 x 0.9: P$1 -0.75,0; P$2 0.75,0
1-282834-0 = drill 1: P$1 -11.43,0; P$2 -8.89,0; P$3 -6.35,0; P$4 -3.81,0; P$5 -1.27,0; P$6 1.27,0; P$7 3.81,0; P$8 6.35,0; P$9 8.89,0; P$10 11.43,0
EVQ-Q2203W = smd 3.2 x 1: 1 -3.4,-2; 2 3.4,-2; 3 -3.4,2; 4 3.4,2
KEYSTONE_5115-5119 = drill 1.3: P$1 0,0
2220 = smd 1.85 x 6.2: P$1 -3.075,0; P$2 3.075,0
LQFP44 = smd 1.9 x 0.4: 1 -5.7,4; 2 -5.7,3.2; 3 -5.7,2.4; 4 -5.7,1.6; 5 -5.7,0.8; 6 -5.7,0; 7 -5.7,-0.8; 8 -5.7,-1.6; 9 -5.7,-2.4; 10 -5.7,-3.2; 11 -5.7,-4; 23 5.7,-4; 24 5.7,-3.2; 25 5.7,-2.4; 26 5.7,-1.6; 27 5.7,-0.8; 28 5.7,0; 29 5.7,0.8; 30 5.7,1.6; 31 5.7,2.4; 32 5.7,3.2; 33 5.7,4 | smd 0.4 x 1.9: 12 -4,-5.7; 13 -3.2,-5.7; 14 -2.4,-5.7; 15 -1.6,-5.7; 16 -0.8,-5.7; 17 0,-5.7; 18 0.8,-5.7; 19 1.6,-5.7; 20 2.4,-5.7; 21 3.2,-5.7; 22 4,-5.7; 34 4,5.7; 35 3.2,5.7; 36 2.4,5.7; 37 1.6,5.7; 38 0.8,5.7; 39 0,5.7; 40 -0.8,5.7; 41 -1.6,5.7; 42 -2.4,5.7; 43 -3.2,5.7; 44 -4,5.7
SOT-23-3 = smd 0.8 x 0.9: P$1 -0.95,-1; P$2 0.95,-1; P$3 0,1
MAX31855_SO-8 = smd 1.98 x 0.53: 1 -2.465,1.905; 2 -2.465,0.635; 3 -2.465,-0.635; 4 -2.465,-1.905; 5 2.465,-1.905; 6 2.465,-0.635; 7 2.465,0.635; 8 2.465,1.905
LM22678_TO-263-EP-7 = smd 0.91 x 2.41: P$1 -3.81,-12.4; P$2 -2.54,-12.4; P$3 -1.27,-12.4; P$4 0,-12.4; P$5 1.27,-12.4; P$6 2.54,-12.4; P$7 3.81,-12.4 | smd 5.59 x 6.35: PAD 0,-3.175
ADP3338_SOT-223-3 = smd 1.1 x 2: 1 -2.3,-2.54; 2 0,-2.54; 3 2.3,-2.54 | smd 3.3 x 2: PAD 0,3.36
SOIC-8_W = smd 2 x 0.5: 1 -3.185,1.905; 2 -3.185,0.635; 3 -3.185,-0.635; 4 -3.185,-1.905; 5 3.185,-1.905; 6 3.185,-0.635; 7 3.185,0.635; 8 3.185,1.905
CD74HC595_SOIC-16 = smd 2 x 0.5: 1 -3.1,4.445; 2 -3.1,3.175; 3 -3.1,1.905; 4 -3.1,0.635; 5 -3.1,-0.635; 6 -3.1,-1.905; 7 -3.1,-3.175; 8 -3.1,-4.445; 9 3.1,-4.445; 10 3.1,-3.175; 11 3.1,-1.905; 12 3.1,-0.635; 13 3.1,0.635; 14 3.1,1.905; 15 3.1,3.175; 16 3.1,4.445
CD74HC165_SOIC-16 = smd 2 x 0.5: 1 -3.1,4.445; 2 -3.1,3.175; 3 -3.1,1.905; 4 -3.1,0.635; 5 -3.1,-0.635; 6 -3.1,-1.905; 7 -3.1,-3.175; 8 -3.1,-4.445; 9 3.1,-4.445; 10 3.1,-3.175; 11 3.1,-1.905; 12 3.1,-0.635; 13 3.1,0.635; 14 3.1,1.905; 15 3.1,3.175; 16 3.1,4.445
7MMX5MM = smd 2.2 x 1.4: P$1 -3.15,-1.27; P$2 -3.15,1.27; P$3 3.15,1.27 | smd 2.4 x 1.4: P$4 3.05,-1.27

### Placement (x,y rotation side)
BOARD_PWR  -242.5,-196 0 top
C1  -191.21,107.02 0 top
C2  -195.02,107.02 0 top
C3  -198.83,107.02 0 top
C4  -202.64,107.02 0 top
C5  132.68,19.02 270 top
C6  -293.5,-248.5 0 top
C7  -283.5,-443.5 0 top
C9  -293.5,-459 0 top
C10  82.56,58.5 90 top
C11  -173.74,-11.43 0 top
C12  -181.36,-16.51 0 top
C14  79.48,58.5 90 top
C15  39.5,57.98 90 top
C16  29.48,58 90 top
C17  26.98,58 90 top
C18  41.73,82.03 0 top
C19  54.05,82.04 0 top
C20  87.12,82.04 0 top
C21  74.99,82.03 0 top
C22  11.48,59.25 90 top
C23  13.98,59.25 90 top
C24  6.63,59.25 180 top
C27  69.36,50.98 180 top
C28  47.86,47 180 top
C29  86.06,58.5 90 top
C30  89.56,58.5 90 top
C31  -175.01,-45.72 0 top
C32  -182.32,110.83 0 top
C33  -186.13,110.83 0 top
C34  -189.94,110.83 0 top
C35  -193.75,110.83 0 top
C38  -216.5,-202 0 top
C39  -212.5,-202 0 top
D2  34.11,88.07 270 top
D3  55.63,61.29 270 top
D4  -169.93,91.44 0 top
D5  -175.01,91.44 0 top
D6  -180.09,91.44 0 top
D7  -225,-203.5 0 top
D8  -201.37,103.21 0 top
D9  -140.72,92.71 0 top
D10  -181.36,-11.43 0 top
DISP1  -291.5,-206.5 0 top
FID1  -182.63,-113.03 0 top
FID2  -182.63,-115.57 0 top
J1  -262,-213 0 top
J2  -269.5,-214.5 0 top
J3  -277,-214.5 0 top
J4  -284.5,-214.5 0 top
L2  63.85,82.13 0 top
L3  59.47,47 90 top
PROP_TC  -251.5,-208 0 top
PROP_UART  -238,-209 0 top
R1  -197.56,110.83 0 top
R2  146.65,13.69 0 top
R3  -293.5,-220.5 0 top
R4  -293.5,-224 0 top
R5  -293.5,-227.5 0 top
R6  -293.5,-231 0 top
R7  -293.5,-234.5 0 top
R8  -293.5,-238 0 top
R9  103.4,4.95 270 top
R10  103.4,16.75 270 top
R11  -161.04,100.33 0 top
R12  -164.85,100.33 0 top
R13  -168.66,100.33 0 top
R14  -293.5,-241.5 0 top
R15  -181.36,-57.15 0 top
R16  -177.55,-57.15 0 top
R17  103.56,28.5 270 top
R18  -293.5,-245 0 top
R19  -251.5,-311 0 top
R20  -248,-311 0 top
R21  -244.5,-311 0 top
R22  -293.5,-316.5 0 top
R23  -290,-316.5 0 top
R24  -286.5,-316.5 0 top
R25  -283,-316.5 0 top
R26  -279.5,-316.5 0 top
R29  -293.5,-462.5 0 top
R30  -293.5,-466 0 top
R47  -293.5,-469.5 0 top
R48  -293.5,-473 0 top
R49  -293.5,-476.5 0 top
R50  -293.5,-480 0 top
R51  -290,-480 0 top
R52  -293.5,-483.5 0 top
RELAYS  -322,-493 0 top
RELAYS1  -322,-506 0 top
SW2  110.18,28.5 0 top
SW3  110.18,16.75 0 top
SW4  110.18,4.95 0 top
TP1  -154.69,85.09 0 top
TP2  -163.58,85.09 0 top
TP3  81.53,89.09 0 top
TP4  48.14,89.09 0 top
TP5  80.64,74.21 0 top
TP6  47.75,74.21 0 top
TVS1  26,78.45 90 top
U1  -220,-170 0 top
U2  -298.5,-486 0 top
U3  -303.5,-486 0 top
U4  -178.82,-6.35 0 top
U5  -233,-191.5 0 top
U6  16.96,58 270 top
U7  -180.09,-49.53 0 top
U8  -308.5,-486 0 top
U9  -169.93,76.2 0 top
U10  -178.82,76.2 0 top
U11  -223,-197 0 top
U12  -313.5,-486 0 top
U13  -318.5,-486 0 top
U14  -290.5,-436 0 top
U16  -290.5,-405 0 top
U17  -323.5,-486 0 top
U18  -328.5,-486 0 top
U19  -333.5,-486 0 top
U$1  -182.63,-110.49 0 top
X1  -207.5,-175 0 top

### Tracks (layer width: path | path; a pad name or v marks a point on that pad's centre or on a via)
3.3V  (36 unrouted)
5V_PWR  (10 unrouted)
12V_BATT  (1 unrouted)
  Top 0.254: 23.66,90.13 D2.1 D2.3 26,83.67 TVS1.P$2
12V_BATT_ON  (2 unrouted)
  Top 0.254: 34.53,84.53 C18.POS 52.66,84.53 C19.POS 60.09,85.92 L2.1
12V_CLEAN  (7 unrouted)
  Top 0.254: L2.2 69,84.53 C21.POS 85.73,84.53 C20.POS
165_CLK  (1 unrouted)
165_DATA  (1 unrouted)
165_LOAD  (1 unrouted)
595_CLK  (1 unrouted)
595_DATA  (1 unrouted)
595_LAT  (1 unrouted)
!RES!_PROP  (2 unrouted)
CHASSIS_GND  (2 unrouted)
  Top 0.254: 7.75,75.38 TVS1.P$1 30.15,79.53 C18.NEG 43.1,78.16 C19.NEG 55.28,76.93 L2.4
D4  (1 unrouted)
D5  (1 unrouted)
D6  (1 unrouted)
D7  (1 unrouted)
E1  (1 unrouted)
E2  (1 unrouted)
GND  (67 unrouted)
  Top 0.254: L2.3 68.8,79.53 C21.NEG 85.75,79.53 C20.NEG
N$2  (1 unrouted)
N$5  (3 unrouted)
N$7  (1 unrouted)
N$8  (1 unrouted)
N$9  (1 unrouted)
N$11  (2 unrouted)
N$12  (2 unrouted)
N$13  (2 unrouted)
N$14  (2 unrouted)
N$15  (2 unrouted)
N$16  (2 unrouted)
N$17  (2 unrouted)
N$18  (2 unrouted)
OUT_OPTO_0  (1 unrouted)
OUT_OPTO_1  (1 unrouted)
OUT_OPTO_2  (1 unrouted)
OUT_OPTO_3  (1 unrouted)
OUT_OPTO_4  (1 unrouted)
OUT_OPTO_5  (1 unrouted)
OUT_OPTO_6  (1 unrouted)
OUT_OPTO_7  (1 unrouted)
P$1  (15 unrouted)
PROP_D4  (1 unrouted)
PROP_D5  (1 unrouted)
PROP_D6  (1 unrouted)
PROP_D7  (1 unrouted)
PROP_E1  (1 unrouted)
PROP_E2  (1 unrouted)
PROP_R/W  (1 unrouted)
PROP_RES  (3 unrouted)
  Top 0.254: C5.2 132.68,15.21 134.23,13.66 | R2.1 145.71,13.66
PROP_RS  (1 unrouted)
R/W  (1 unrouted)
RLY_0  (1 unrouted)
RLY_1  (1 unrouted)
RLY_2  (1 unrouted)
RLY_3  (1 unrouted)
RLY_4  (1 unrouted)
RLY_5  (1 unrouted)
RLY_6  (1 unrouted)
RLY_7  (1 unrouted)
RS  (1 unrouted)
RX_PROP  (2 unrouted)
SCL  (2 unrouted)
SDA  (2 unrouted)
SW_D  (3 unrouted)
SW_S  (3 unrouted)
SW_U  (3 unrouted)
T+_0  (3 unrouted)
T+_1  (7 unrouted)
T+_2  (3 unrouted)
T-_0  (3 unrouted)
T-_1  (7 unrouted)
T-_2  (3 unrouted)
TC_CS_0  (1 unrouted)
TC_CS_1  (1 unrouted)
TC_CS_2  (1 unrouted)
TC_CS_3  (1 unrouted)
TC_SCK  (4 unrouted)
TC_SO  (4 unrouted)
TX_PROP  (2 unrouted)
X0  (1 unrouted)
X1  (1 unrouted)